# Altium schematic sheet SH03 - ETHERNET MUXES.SchDoc
size 386 x 246 mm
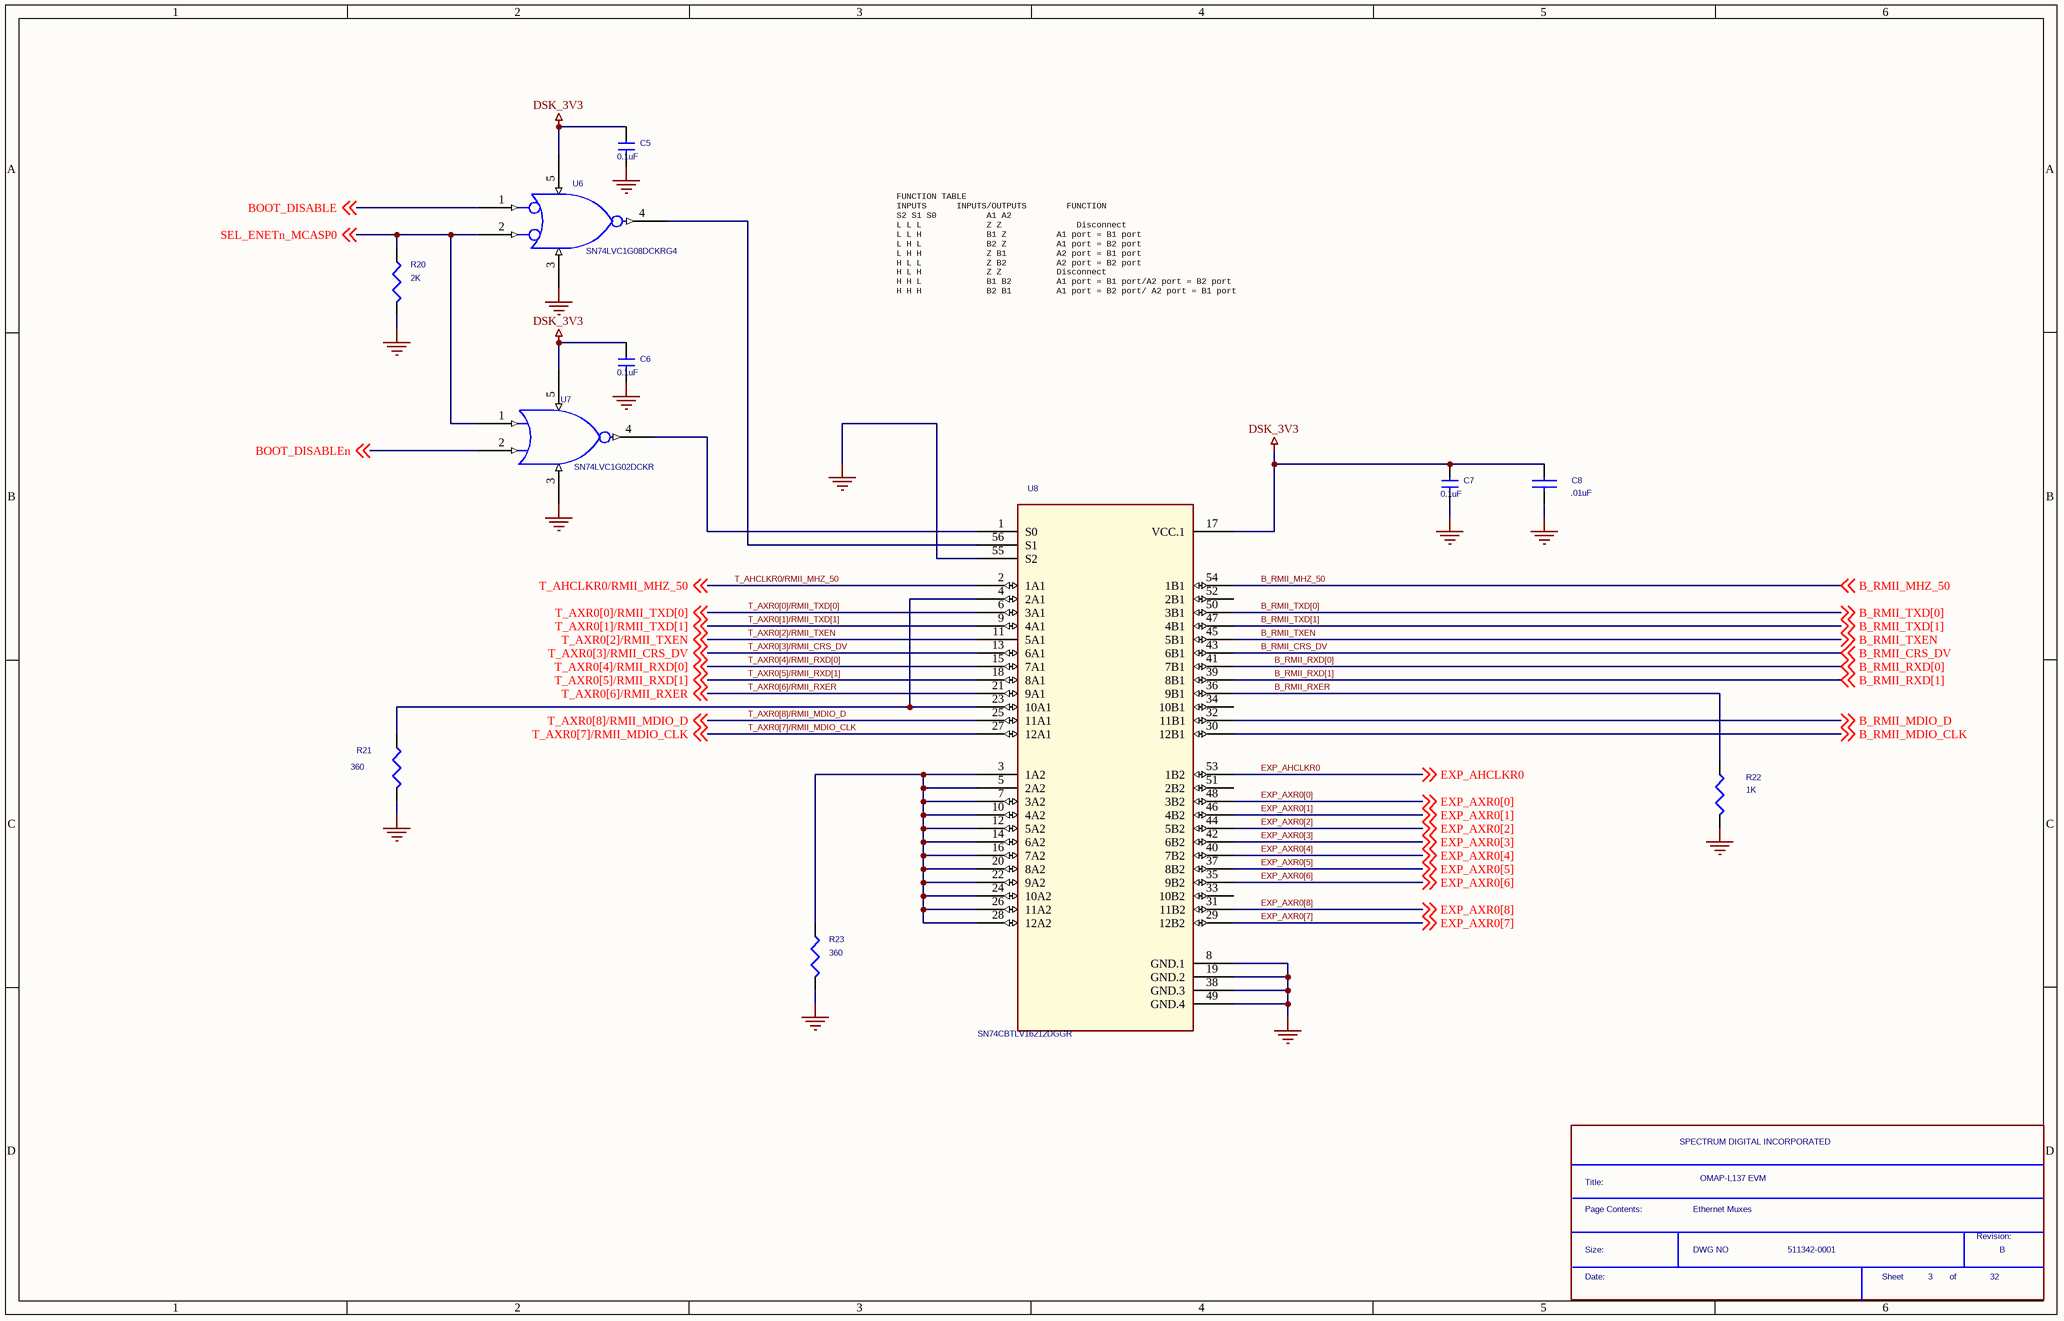
[diagram p0: SH03 - ETHERNET MUXES.SchDoc]

## Parts
*  Page Contents:: Ethernet Muxes  RevCode: B  Title: OMAP-L137 EVM  OrgName: SPECTRUM DIGITAL INCORPORATED  Doc: 511342-0001  Page Number: 3  Page Count: 32  (hidden comment: SDTitleBlock)  (graphical)
C5  0.1uF  [c402-25]
C6  0.1uF  [c402-25]
C7  0.1uF  [c402-25]
C8  .01uF  [c402-25]
R20  2K  [r402-25]
R21  360  [r402-25]
R22  1K  [r402-25]
R23  360  [r402-25]
U6  SN74LVC1G08DCKRG4  [SO5]
U7  SN74LVC1G02DCKR  [dck-5]
U8  SN74CBTLV16212DGGR  [56 pin TSSOP]

## Nets
DSK_3V3: C5.1 C6.1 C7.1 C8.1 U6.5(VCC) U7.5(VCC) U8.17(VCC.1)
GND: C5.2 C6.2 C7.2 C8.2 R20.2 R21.1 R22.2 R23.2 U6.3(GND) U7.3(GND) U8.8(GND.1) U8.19(GND.2) U8.38(GND.3) U8.49(GND.4) U8.55(S2)
B_RMII_CRS_DV: U8.43(6B1) ; off-sheet B_RMII_CRS_DV
B_RMII_MDIO_CLK: U8.30(12B1) ; off-sheet B_RMII_MDIO_CLK
B_RMII_MDIO_D: U8.32(11B1) ; off-sheet B_RMII_MDIO_D
B_RMII_MHZ_50: U8.54(1B1) ; off-sheet B_RMII_MHZ_50
B_RMII_RXD[0]: U8.41(7B1) ; off-sheet B_RMII_RXD[0]
B_RMII_RXD[1]: U8.39(8B1) ; off-sheet B_RMII_RXD[1]
B_RMII_RXER: R22.1 U8.36(9B1)
B_RMII_TXD[0]: U8.50(3B1) ; off-sheet B_RMII_TXD[0]
B_RMII_TXD[1]: U8.47(4B1) ; off-sheet B_RMII_TXD[1]
B_RMII_TXEN: U8.45(5B1) ; off-sheet B_RMII_TXEN
BOOT_DISABLE: U6.1(B) ; off-sheet BOOT_DISABLE
BOOT_DISABLEn: U7.2(A) ; off-sheet BOOT_DISABLEn
EXP_AHCLKR0: U8.53(1B2) ; off-sheet EXP_AHCLKR0
EXP_AXR0[0]: U8.48(3B2) ; off-sheet EXP_AXR0[0]
EXP_AXR0[1]: U8.46(4B2) ; off-sheet EXP_AXR0[1]
EXP_AXR0[2]: U8.44(5B2) ; off-sheet EXP_AXR0[2]
EXP_AXR0[3]: U8.42(6B2) ; off-sheet EXP_AXR0[3]
EXP_AXR0[4]: U8.40(7B2) ; off-sheet EXP_AXR0[4]
EXP_AXR0[5]: U8.37(8B2) ; off-sheet EXP_AXR0[5]
EXP_AXR0[6]: U8.35(9B2) ; off-sheet EXP_AXR0[6]
EXP_AXR0[7]: U8.29(12B2) ; off-sheet EXP_AXR0[7]
EXP_AXR0[8]: U8.31(11B2) ; off-sheet EXP_AXR0[8]
SEL_ENETn_MCASP0: R20.1 U6.2(A) U7.1(B) ; off-sheet SEL_ENETn_MCASP0
T_AHCLKR0/RMII_MHZ_50: U8.2(1A1) ; off-sheet T_AHCLKR0/RMII_MHZ_50
T_AXR0[0]/RMII_TXD[0]: U8.6(3A1) ; off-sheet T_AXR0[0]/RMII_TXD[0]
T_AXR0[1]/RMII_TXD[1]: U8.9(4A1) ; off-sheet T_AXR0[1]/RMII_TXD[1]
T_AXR0[2]/RMII_TXEN: U8.11(5A1) ; off-sheet T_AXR0[2]/RMII_TXEN
T_AXR0[3]/RMII_CRS_DV: U8.13(6A1) ; off-sheet T_AXR0[3]/RMII_CRS_DV
T_AXR0[4]/RMII_RXD[0]: U8.15(7A1) ; off-sheet T_AXR0[4]/RMII_RXD[0]
T_AXR0[5]/RMII_RXD[1]: U8.18(8A1) ; off-sheet T_AXR0[5]/RMII_RXD[1]
T_AXR0[6]/RMII_RXER: U8.21(9A1) ; off-sheet T_AXR0[6]/RMII_RXER
T_AXR0[7]/RMII_MDIO_CLK: U8.27(12A1) ; off-sheet T_AXR0[7]/RMII_MDIO_CLK
T_AXR0[8]/RMII_MDIO_D: U8.25(11A1) ; off-sheet T_AXR0[8]/RMII_MDIO_D
NetR21_2: R21.2 U8.4(2A1) U8.23(10A1)
NetR23_1: R23.1 U8.3(1A2) U8.5(2A2) U8.7(3A2) U8.10(4A2) U8.12(5A2) U8.14(6A2) U8.16(7A2) U8.20(8A2) U8.22(9A2) U8.24(10A2) U8.26(11A2) U8.28(12A2)
NetU6_4: U6.4(Y) U8.56(S1)
NetU7_4: U7.4(Y) U8.1(S0)

Not connected (* = marked no-connect by the designer): U8 33(10B2) 34(10B1) 51(2B2) 52(2B1)

## Notes on the sheet
- FUNCTION TABLE
  INPUTS      INPUTS/OUTPUTS        FUNCTION
  S2 S1 S0          A1 A2
  L L L             Z Z               Disconnect
  L L H             B1 Z          A1 port = B1 port
  L H L             B2 Z          A1 port = B2 port
  L H H             Z B1          A2 port = B1 port
  H L L             Z B2          A2 port = B2 port
  H L H             Z Z           Disconnect
  H H L             B1 B2         A1 port = B1 port/A2 port = B2 port
  H H H             B2 B1         A1 port = B2 port/ A2 port = B1 port
- (in symbol SDTitleBlock) Title:; Page Contents:; Revision:; Size:; DWG NO; Date:; Sheet; of

## Library data of the parts
C5-C7 = CAP NP_1: Part #: 101587-1100R
C8 = CAP NP_0: Part #: 101587-1101R
R20 = R: Part #: 101370-2002R
R21 R23 = R: Part #: 101370-3601R
R22 = R_0: Part #: 101370-1002R
U6 = 1G08: Part #: 101057-0008R
U7 = 1g02_0: Part #: 101057-0002R
U8 = SN74CBT16212DGGR: Part #: 102693-0001R; SD PCB Footprint: TSSOP56